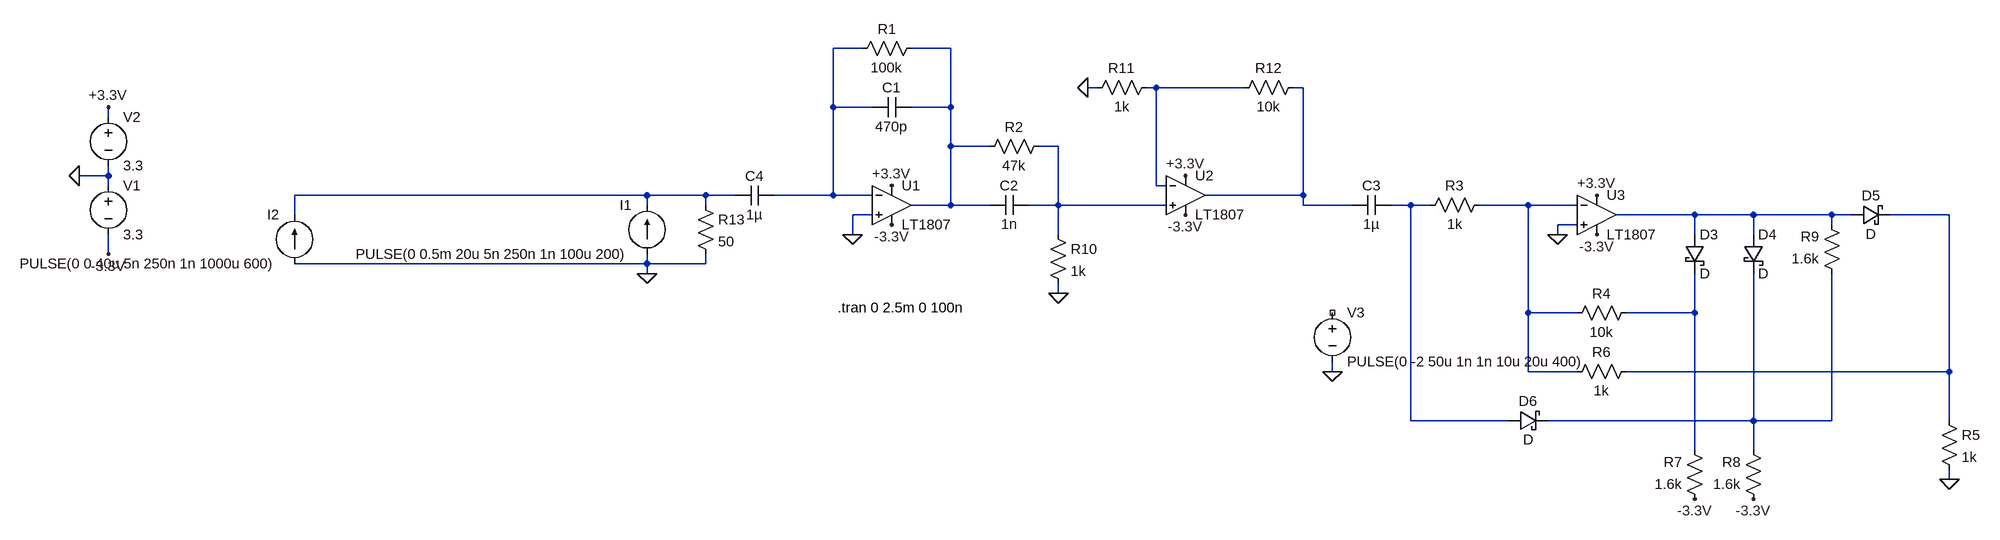
[diagram p0: schematic BLR.asc]
BLR.asc, the LTspice schematic file:
Version 4
SHEET 1 1944 700
WIRE 112 -144 64 -144
WIRE 256 -144 192 -144
WIRE 496 -80 480 -80
WIRE 592 -80 576 -80
WIRE 736 -80 592 -80
WIRE 832 -80 816 -80
WIRE 64 -48 64 -144
WIRE 128 -48 64 -48
WIRE 256 -48 256 -144
WIRE 256 -48 192 -48
WIRE -1120 -32 -1120 -48
WIRE 256 16 256 -48
WIRE 320 16 256 16
WIRE 432 16 400 16
WIRE -1120 64 -1120 48
WIRE -1120 64 -1168 64
WIRE -1120 80 -1120 64
WIRE 592 80 592 -80
WIRE 608 80 592 80
WIRE -240 96 -816 96
WIRE -144 96 -240 96
WIRE -96 96 -144 96
WIRE 64 96 64 -48
WIRE 64 96 -32 96
WIRE 128 96 64 96
WIRE 832 96 832 -80
WIRE 832 96 672 96
WIRE -240 112 -240 96
WIRE -144 112 -144 96
WIRE 256 112 256 16
WIRE 256 112 192 112
WIRE 320 112 256 112
WIRE 432 112 432 16
WIRE 432 112 384 112
WIRE 608 112 432 112
WIRE 832 112 832 96
WIRE 912 112 832 112
WIRE 1008 112 976 112
WIRE 1040 112 1008 112
WIRE 1200 112 1120 112
WIRE 1280 112 1200 112
WIRE -816 128 -816 96
WIRE 128 128 96 128
WIRE 1472 128 1344 128
WIRE 1568 128 1472 128
WIRE 1696 128 1568 128
WIRE 1728 128 1696 128
WIRE 1888 128 1792 128
WIRE 1280 144 1248 144
WIRE 1696 144 1696 128
WIRE 96 160 96 128
WIRE 432 160 432 112
WIRE 1248 160 1248 144
WIRE 1472 160 1472 128
WIRE 1568 160 1568 128
WIRE -1120 192 -1120 160
WIRE -240 208 -240 192
WIRE -240 208 -816 208
WIRE -144 208 -144 192
WIRE -144 208 -240 208
WIRE -240 224 -240 208
WIRE 432 256 432 240
WIRE 1200 288 1200 112
WIRE 1280 288 1200 288
WIRE 1472 288 1472 224
WIRE 1472 288 1360 288
WIRE 880 384 880 368
WIRE 1200 384 1200 288
WIRE 1280 384 1200 384
WIRE 1888 384 1888 128
WIRE 1888 384 1360 384
WIRE 1008 464 1008 112
WIRE 1168 464 1008 464
WIRE 1568 464 1568 224
WIRE 1568 464 1232 464
WIRE 1696 464 1696 224
WIRE 1696 464 1568 464
WIRE 1888 464 1888 384
WIRE 1472 512 1472 288
WIRE 1568 512 1568 464
WIRE 1888 560 1888 544
FLAG -240 224 0
FLAG -1168 64 0
FLAG -1120 -48 +3.3V
FLAG -1120 192 -3.3V
FLAG 160 144 -3.3V
FLAG 160 80 +3.3V
FLAG 1888 560 0
FLAG 96 160 0
FLAG 1312 160 -3.3V
FLAG 1312 96 +3.3V
FLAG 1248 160 0
FLAG 1472 592 -3.3V
FLAG 1568 592 -3.3V
FLAG 432 256 0
FLAG 640 128 -3.3V
FLAG 640 64 +3.3V
FLAG 480 -80 0
FLAG 880 384 0
SYMBOL current -240 192 R180
WINDOW 0 24 80 Left 2
WINDOW 3 24 0 Left 2
WINDOW 123 0 0 Left 0
WINDOW 39 0 0 Left 0
SYMATTR InstName I1
SYMATTR Value PULSE(0 0.5m 20u 5n 250n 1n 100u 200)
SYMBOL OpAmps\\LT1807 160 48 R0
SYMATTR InstName U1
SYMBOL cap 192 -64 R90
WINDOW 0 0 32 VBottom 2
WINDOW 3 32 32 VTop 2
SYMATTR InstName C1
SYMATTR Value 470p
SYMBOL cap 384 96 R90
WINDOW 0 0 32 VBottom 2
WINDOW 3 32 32 VTop 2
SYMATTR InstName C2
SYMATTR Value 1n
SYMBOL res 208 -160 R90
WINDOW 0 0 56 VBottom 2
WINDOW 3 32 56 VTop 2
SYMATTR InstName R1
SYMATTR Value 100k
SYMBOL voltage -1120 64 R0
WINDOW 123 0 0 Left 0
WINDOW 39 0 0 Left 0
SYMATTR InstName V1
SYMATTR Value 3.3
SYMBOL voltage -1120 -48 R0
WINDOW 123 0 0 Left 0
WINDOW 39 0 0 Left 0
SYMATTR InstName V2
SYMATTR Value 3.3
SYMBOL res 1872 448 R0
SYMATTR InstName R5
SYMATTR Value 1k
SYMBOL OpAmps\\LT1807 1312 64 R0
SYMATTR InstName U3
SYMBOL res 1136 96 R90
WINDOW 0 0 56 VBottom 2
WINDOW 3 32 56 VTop 2
SYMATTR InstName R3
SYMATTR Value 1k
SYMBOL res 1376 272 R90
WINDOW 0 0 56 VBottom 2
WINDOW 3 32 56 VTop 2
SYMATTR InstName R4
SYMATTR Value 10k
SYMBOL res 1376 368 R90
WINDOW 0 0 56 VBottom 2
WINDOW 3 32 56 VTop 2
SYMATTR InstName R6
SYMATTR Value 1k
SYMBOL res 1488 608 R180
WINDOW 0 36 76 Left 2
WINDOW 3 36 40 Left 2
SYMATTR InstName R7
SYMATTR Value 1.6k
SYMBOL res 1584 608 R180
WINDOW 0 36 76 Left 2
WINDOW 3 36 40 Left 2
SYMATTR InstName R8
SYMATTR Value 1.6k
SYMBOL schottky 1456 160 R0
SYMATTR InstName D3
SYMBOL schottky 1552 160 R0
SYMATTR InstName D4
SYMBOL res 1712 240 R180
WINDOW 0 36 76 Left 2
WINDOW 3 36 40 Left 2
SYMATTR InstName R9
SYMATTR Value 1.6k
SYMBOL schottky 1728 144 R270
WINDOW 0 32 32 VTop 2
WINDOW 3 0 32 VBottom 2
SYMATTR InstName D5
SYMBOL schottky 1168 480 R270
WINDOW 0 32 32 VTop 2
WINDOW 3 0 32 VBottom 2
SYMATTR InstName D6
SYMBOL res 416 0 R90
WINDOW 0 0 56 VBottom 2
WINDOW 3 32 56 VTop 2
SYMATTR InstName R2
SYMATTR Value 47k
SYMBOL res 416 144 R0
SYMATTR InstName R10
SYMATTR Value 1k
SYMBOL OpAmps\\LT1807 640 32 R0
SYMATTR InstName U2
SYMBOL res 592 -96 R90
WINDOW 0 0 56 VBottom 2
WINDOW 3 32 56 VTop 2
SYMATTR InstName R11
SYMATTR Value 1k
SYMBOL res 832 -96 R90
WINDOW 0 0 56 VBottom 2
WINDOW 3 32 56 VTop 2
SYMATTR InstName R12
SYMATTR Value 10k
SYMBOL voltage 880 272 R0
WINDOW 123 0 0 Left 0
WINDOW 39 0 0 Left 0
SYMATTR InstName V3
SYMATTR Value PULSE(0 -2 50u 1n 1n 10u 20u 400)
SYMBOL cap 976 96 R90
WINDOW 0 0 32 VBottom 2
WINDOW 3 32 32 VTop 2
SYMATTR InstName C3
SYMATTR Value 1µ
SYMBOL res -160 96 R0
SYMATTR InstName R13
SYMATTR Value 50
SYMBOL cap -32 80 R90
WINDOW 0 0 32 VBottom 2
WINDOW 3 32 32 VTop 2
SYMATTR InstName C4
SYMATTR Value 1µ
SYMBOL current -816 208 R180
WINDOW 0 24 80 Left 2
WINDOW 3 24 0 Left 2
WINDOW 123 0 0 Left 0
WINDOW 39 0 0 Left 0
SYMATTR InstName I2
SYMATTR Value PULSE(0 0 40u 5n 250n 1n 1000u 600)
TEXT 72 280 Left 2 !.tran 0 2.5m 0 100n

The netlist it stands for:
* BLR.asc
I1 0 N006 PULSE(0 0.5m 20u 5n 250n 1n 100u 200)
XU1 0 N001 +3.3V -3.3V N002 LT1807  ; pins In+ In- V+ V- OUT
C1 N002 N001 470p
C2 N005 N002 1n
R1 N002 N001 100k
V1 0 -3.3V 3.3
V2 +3.3V 0 3.3
R5 N010 0 1k
XU3 0 N008 +3.3V -3.3V N009 LT1807  ; pins In+ In- V+ V- OUT
R3 N008 N007 1k
R4 N011 N008 10k
R6 N010 N008 1k
R7 -3.3V N011 1.6k
R8 -3.3V N012 1.6k
D3 N009 N011 D
D4 N009 N012 D
R9 N012 N009 1.6k
D5 N009 N010 D
D6 N007 N012 D
R2 N005 N002 47k
R10 N005 0 1k
XU2 N005 N003 +3.3V -3.3V N004 LT1807  ; pins In+ In- V+ V- OUT
R11 N003 0 1k
R12 N004 N003 10k
V3 NC_01 0 PULSE(0 -2 50u 1n 1n 10u 20u 400)
C3 N007 N004 1µ
R13 N006 0 50
C4 N001 N006 1µ
I2 0 N006 PULSE(0 0 40u 5n 250n 1n 1000u 600)
.model D D
.lib standard.dio
.tran 0 2.5m 0 100n
.backanno
.end